# Altium schematic sheet Test and Fiducials.SchDoc
size A4; Organization: Altium Limited; Address1: L3, 12a Rodborough Rd; Address2: Frenchs Forest; Address3: NSW; Address4: Australia 2086
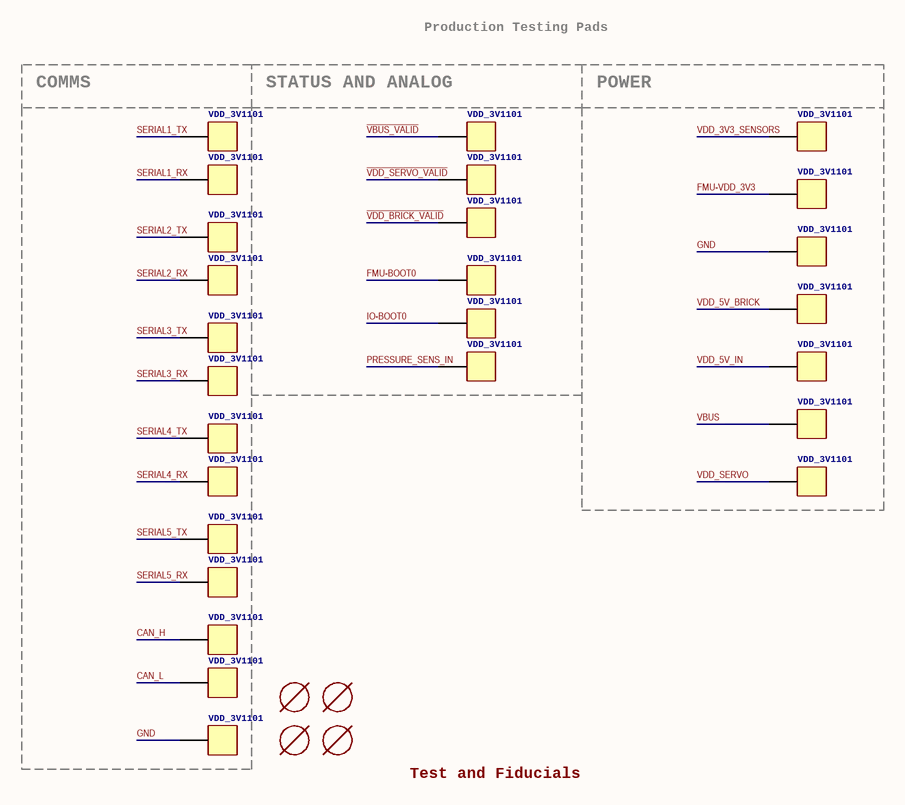
[diagram p0: Test and Fiducials.SchDoc]

## Parts
!VBUS_VALID  >NAME: VDD_3V1101  [PAD.04X.04]  (hidden comment: PAD.04)
!VDD_BRICK_VALID  >NAME: VDD_3V1101  [PAD.04X.04]  (hidden comment: PAD.04)
!VDD_SERVO_VALID  >NAME: VDD_3V1101  [PAD.04X.04]  (hidden comment: PAD.04)
ADC_PR  >NAME: VDD_3V1101  [PAD.04X.04]  (hidden comment: PAD.04)
CAN_H  >NAME: VDD_3V1101  [PAD.04X.04]  (hidden comment: PAD.04)
CAN_L  >NAME: VDD_3V1101  [PAD.04X.04]  (hidden comment: PAD.04)
FMU-BOOT1101  >NAME: VDD_3V1101  [PAD.04X.04]  (hidden comment: PAD.04)
GND  >NAME: VDD_3V1101  [PAD.04X.04]  (hidden comment: PAD.04)
GND.  >NAME: VDD_3V1101  [PAD.04X.04]  (hidden comment: PAD.04)
IO-BOOT1101  >NAME: VDD_3V1101  [PAD.04X.04]  (hidden comment: PAD.04)
M3_MOUNT1101  MOUNT-HOLE3.1MM  [MOUNT-HOLE3.1]  (value not drawn)
M3_MOUNT1102  MOUNT-HOLE3.1MM  [MOUNT-HOLE3.1]  (value not drawn)
M3_MOUNT1103  MOUNT-HOLE3.1MM  [MOUNT-HOLE3.1]  (value not drawn)
M3_MOUNT1104  MOUNT-HOLE3.1MM  [MOUNT-HOLE3.1]  (value not drawn)
S1RX  >NAME: VDD_3V1101  [PAD.04X.04]  (hidden comment: PAD.04)
S1TX  >NAME: VDD_3V1101  [PAD.04X.04]  (hidden comment: PAD.04)
S2RX  >NAME: VDD_3V1101  [PAD.04X.04]  (hidden comment: PAD.04)
S2TX  >NAME: VDD_3V1101  [PAD.04X.04]  (hidden comment: PAD.04)
S3RX  >NAME: VDD_3V1101  [PAD.04X.04]  (hidden comment: PAD.04)
S3TX  >NAME: VDD_3V1101  [PAD.04X.04]  (hidden comment: PAD.04)
S4RX  >NAME: VDD_3V1101  [PAD.04X.04]  (hidden comment: PAD.04)
S4TX  >NAME: VDD_3V1101  [PAD.04X.04]  (hidden comment: PAD.04)
S5_RX  >NAME: VDD_3V1101  [PAD.04X.04]  (hidden comment: PAD.04)
S5_TX  >NAME: VDD_3V1101  [PAD.04X.04]  (hidden comment: PAD.04)
VBUS  >NAME: VDD_3V1101  [PAD.04X.04]  (hidden comment: PAD.04)
VDD_3V1101  >NAME: VDD_3V1101  [PAD.04X.04]  (hidden comment: PAD.04)
VDD_5V_BRICK  >NAME: VDD_3V1101  [PAD.04X.04]  (hidden comment: PAD.04)
VDD_5V_IN  >NAME: VDD_3V1101  [PAD.04X.04]  (hidden comment: PAD.04)
VDD_SERVO  >NAME: VDD_3V1101  [PAD.04X.04]  (hidden comment: PAD.04)
VDDA_3V1101  >NAME: VDD_3V1101  [PAD.04X.04]  (hidden comment: PAD.04)

## Nets
CAN_H: CAN_H.P$1
CAN_L: CAN_L.P$1
FMU-BOOT0: FMU-BOOT1101.P$1
FMU-VDD_3V3: VDD_3V1101.P$1
GND: GND.P$1 GND..P$1
IO-BOOT0: IO-BOOT1101.P$1
PRESSURE_SENS_IN: ADC_PR.P$1
SERIAL1_RX: S1RX.P$1
SERIAL1_TX: S1TX.P$1
SERIAL2_RX: S2RX.P$1
SERIAL2_TX: S2TX.P$1
SERIAL3_RX: S3RX.P$1
SERIAL3_TX: S3TX.P$1
SERIAL4_RX: S4RX.P$1
SERIAL4_TX: S4TX.P$1
SERIAL5_RX: S5_RX.P$1
SERIAL5_TX: S5_TX.P$1
~{VBUS_VALID}: !VBUS_VALID.P$1
~{VDD_BRICK_VALID}: !VDD_BRICK_VALID.P$1
~{VDD_SERVO_VALID}: !VDD_SERVO_VALID.P$1
VBUS: VBUS.P$1
VDD_3V3_SENSORS: VDDA_3V1101.P$1
VDD_5V_BRICK: VDD_5V_BRICK.P$1
VDD_5V_IN: VDD_5V_IN.P$1
VDD_SERVO: VDD_SERVO.P$1

## Notes on the sheet
- Production Testing Pads
- COMMS
- STATUS AND ANALOG
- POWER
- Test and Fiducials
- Title
- Size:
- Date:
- A4
- Number:
- Time:
- Revision:
- Sheet
- of
- File:

## Library data of the parts
!VBUS_VALID !VDD_BRICK_VALID !VDD_SERVO_VALID ADC_PR CAN_H CAN_L FMU-BOOT1101 GND GND. IO-BOOT1101 S1RX S1TX S2RX S2TX S3RX S3TX S4RX S4TX S5_RX S5_TX VBUS VDD_3V1101 VDD_5V_BRICK VDD_5V_IN VDD_SERVO VDDA_3V1101 = PAD.04: <h3>Test pad</h3> / This footprint includes three classes: The actual test pads, a pogo-pin footprint to mount the pogo-pin as through-hole part and a hole footprint which allows the head of the pogo-pin to pass through (do NOT use the hole to mount the pogo-pin). In a typical test setup, the stack would consist of three PCBs: The actual PCB under testing with a test pad on the bottom, then a second PCB with the hole for the pogo-pin head where the PCB under testing is pressed on and a third PCB at 30 mm / 1.2" distance with the pogo-pin footprints. The pogo-pins are soldered to the last PCB. To create the stack, copy the board under testing and exchange the footprints - this way the correct positioning is ensured.; BOM: EXCLUDE; PARTNO: *
M3_MOUNT1101-M3_MOUNT1104 = MOUNT-HOLE3.1MM: BOM: EXCLUDE; PARTNO: *